# Altium schematic sheet Sheet2 (3).SchDoc
size Legal
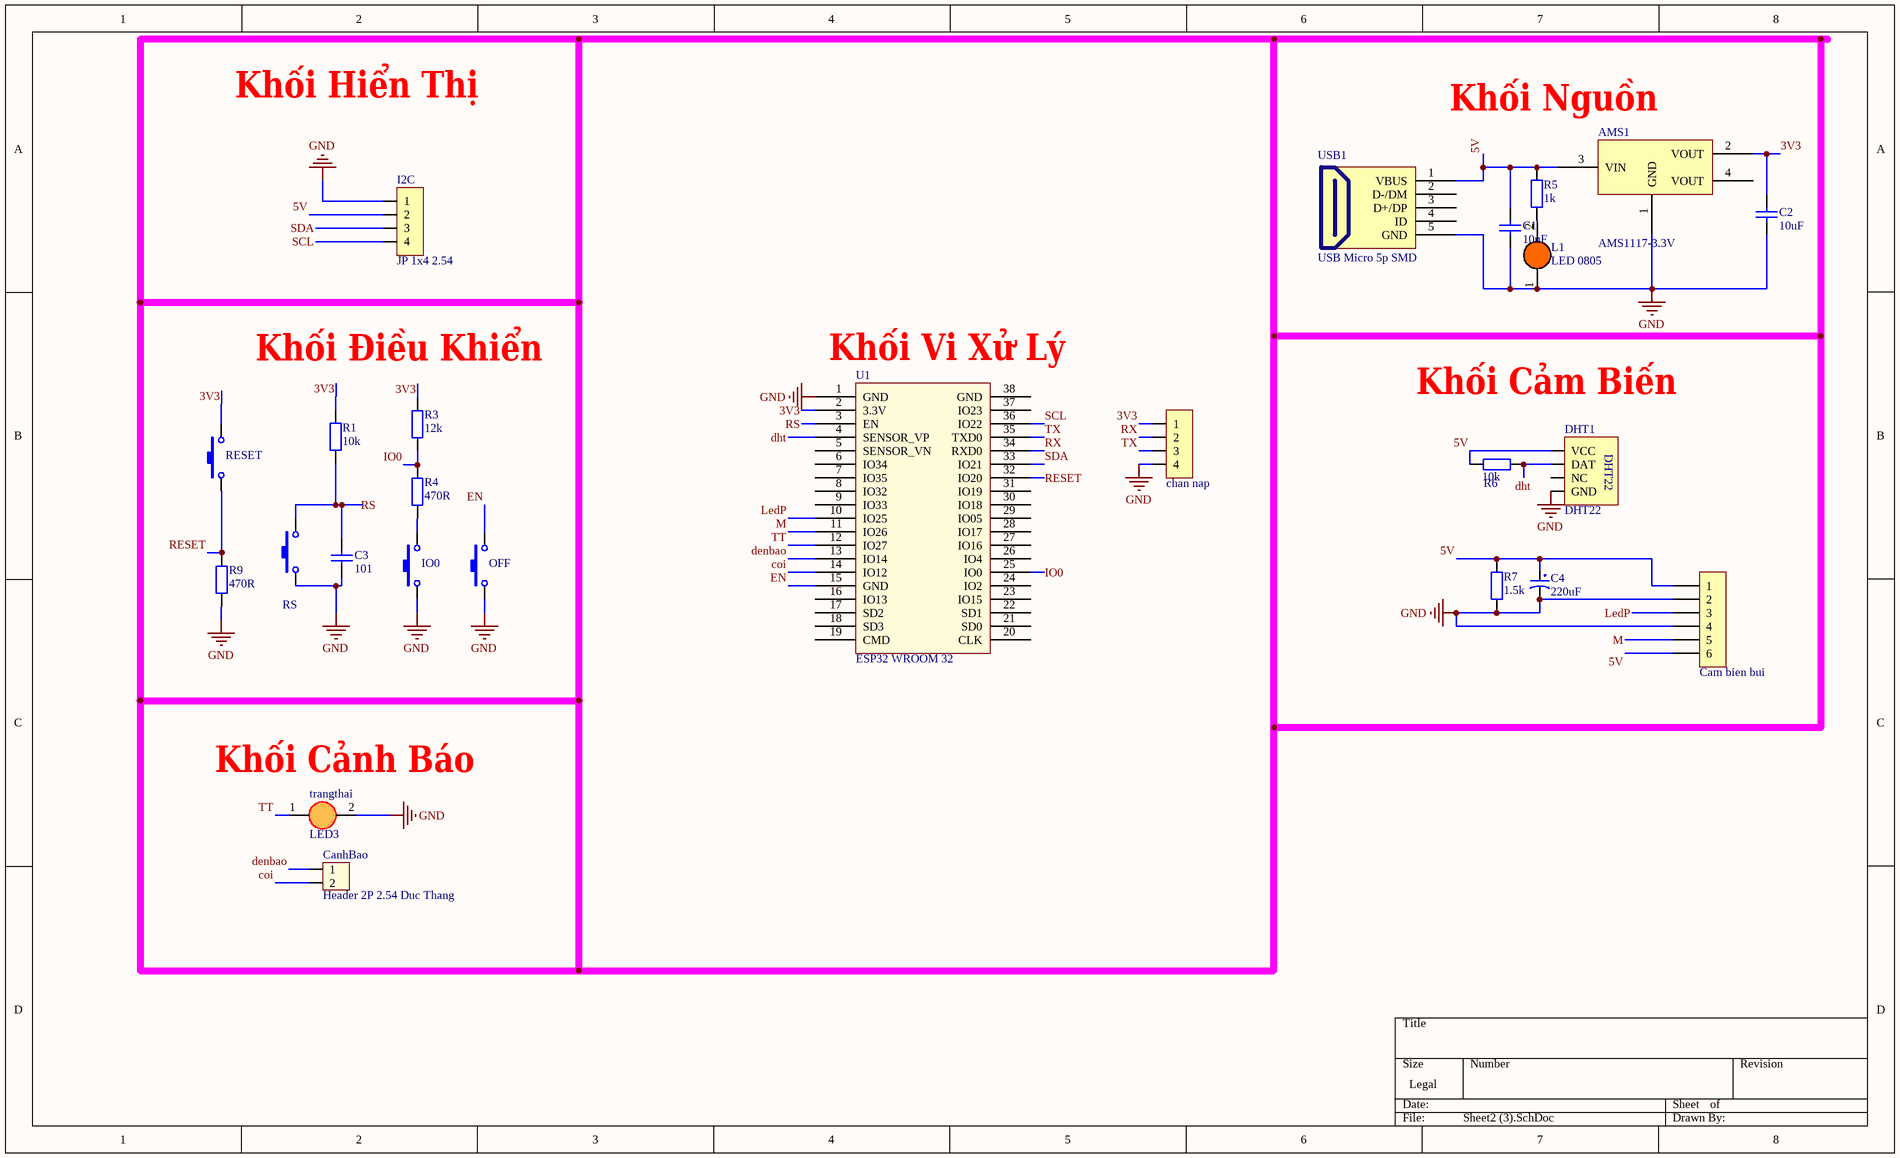
[diagram p0: Sheet2 (3).SchDoc]

## Parts
AMS1  AMS1117-3.3V  [SOT223]
C1  10uF  [tu 0805]
C2  10uF  [tu 0805]
C3  101  [tu 0805]
C4  220uF  [Tu hoa 5mm]
Cam_bien_bui  Cam bien bui  [XH2.54M-6]
CanhBao  Header 2P 2.54 Duc Thang  [XH2.54M-2]
DHT1  DHT22  [DHT22]
I2C  JP 1x4 2.54  [JP 1x4 DT]
IO0  Nut Nhan 2 Chan SMD 3x6x2.5  [Nut Nhan 2 Chan SMD 3x6x2.5]  (value not drawn)
JP1  chan nap  [JP 1x4 CT]
L1  LED 0805  [LED-0805-Orange]
OFF  Nut Nhan 2 Chan SMD 3x6x2.5  [Nut Nhan 2 Chan SMD 3x6x2.5]  (value not drawn)
R1  10k  [tro smd 0805]
R3  12k  [tro smd 0805]
R4  470R  [Tro SMD 0805]
R5  1k  [tro smd 0805]
R6  10k  [tro smd 0805]
R7  1.5k  [tro vach 1/4w]
R9  470R  [Tro SMD 0805]
RESET  Nut Nhan 2 Chan SMD 3x6x2.5  [Nut Nhan 2 Chan SMD 3x6x2.5]  (value not drawn)
RS  Nut Nhan 2 Chan SMD 3x6x2.5  [Nut Nhan 2 Chan SMD 3x6x2.5]  (value not drawn)
trangthai  LED3  [LED3mm]
U1  ESP32 WROOM 32  [ESP32-WROOM-32D]
USB1  USB Micro 5p SMD  [USB Micro 5p SMD]

## Nets
GND: AMS1.1(GND) C1.2 C2.2 C3.2 C4.2 Cam_bien_bui.2 Cam_bien_bui.4 DHT1.4(GND) I2C.1 IO0.1 JP1.4 L1.1(A) OFF.1 R7.1 R9.1 RS.1 trangthai.2(K) U1.1(GND) USB1.5(GND)
3V3: AMS1.2(VOUT) C2.1 JP1.1 R1.2 R3.2 RESET.2 U1.2(3.3V)
5V: AMS1.3(VIN) C1.1 C4.1 Cam_bien_bui.1 Cam_bien_bui.6 DHT1.1(VCC) I2C.2 R5.2 R6.1 R7.2 USB1.1(VBUS)
coi: CanhBao.2 U1.14(IO12)
denbao: CanhBao.1 U1.13(IO14)
dht: DHT1.2(DAT) R6.2 U1.4(SENSOR_VP)
EN: OFF.2 U1.15(GND)
IO0: R3.1 R4.2 U1.25(IO0)
LedP: Cam_bien_bui.3 U1.10(IO25)
M: Cam_bien_bui.5 U1.11(IO26)
RESET: R9.2 RESET.1 U1.32(IO20)
RS: C3.1 R1.1 RS.2 U1.3(EN)
RX: JP1.2 U1.34(RXD0)
SCL: I2C.4 U1.36(IO22)
SDA: I2C.3 U1.33(IO21)
TT: trangthai.1(A) U1.12(IO27)
TX: JP1.3 U1.35(TXD0)
NetIO0_2: IO0.2 R4.1
NetL1_2: L1.2(K) R5.1

Not connected (* = marked no-connect by the designer): AMS1 4(VOUT); DHT1 3(NC); U1 5(SENSOR_VN) 6(IO34) 7(IO35) 8(IO32) 9(IO33) 16(IO13) 17(SD2) 18(SD3) 19(CMD) 20(CLK) 21(SD0) 22(SD1) 23(IO15) 24(IO2) 26(IO4) 27(IO16) 28(IO17) 29(IO05) 30(IO18) 31(IO19) 37(IO23) 38(GND); USB1 2(D-/DM) 3(D+/DP) 4(ID)

## Notes on the sheet
- Khối Hiển Thị
- (near AMS1) Khối Nguồn
- Khối Điều Khiển
- (near U1) Khối Vi Xử Lý
- Khối Cảm Biến
- (near trangthai) Khối Cảnh Báo

## Library data of the parts
AMS1 = AMS1117 SMD: Dán; Value: AMS1117-3.3V SOT223; Don_Vi: Con; Ma_Hang: MH000596; Ghi_Chu: *; Kieu_Chan: *; Chung_Loai: Dán
C1 C2 = Tu 0805 10pF 50V 10%: Dán; Don_Vi: Con; So_Chan: 2; Ten_Linh_Kien: Tụ 0805 10P 10% 50V; Ma_Hang: MH004554; Chung_Loai: Dán; Kieu_Chan: *
C3 = Tu 0805 101 50V 20%: Dán; Don_Vi: Con; So_Chan: 2; Ten_Linh_Kien: Tụ 0805 101-0.1nF 50V 20%; Ma_Hang: MH002806; Chung_Loai: Dán; Kieu_Chan: *
C4 = Tu Hoa 220uF 16V 6x11: Cắm; Don_Vi: Con; So_Chan: 2; Ten_Linh_Kien: Tụ Hóa 220uF 16V 6x11MM; Ma_Hang: MH001348; Chung_Loai: Cắm; Kieu_Chan: *
Cam_bien_bui = Header 6P 2.54 Duc Thang: Cắm; Ten_Linh_Kien: Header 6P XH2.54-6P Đực Thẳng; Don_Vi: Con; Ma_Hang: MH001972; Chung_Loai: Cắm
CanhBao = Header 2P 2.54 Duc Thang: Cắm; Ten_Linh_Kien: Header 2P XH2.54-2P Đực Thẳng; Don_Vi: Con; Ma_Hang: MH001283; Chung_Loai: Cắm
DHT1 = DHT22: Manufacturer: W¨¹rth Elektronik eiSos GmbH; partNo: 613004143121; ComponentLink1 Description: Manufacturer; ComponentLink2 Description: Datasheet; NoPins: 04; Created Date: 29 March 2013; ComponentLink1URL: http://www.we-online.com; ComponentLink2URL: http://katalog.we-online.de/em/datasheet/6130xx143121.pdf; Created by: Karrer Zheng
I2C = JP 1x4 2.54 Duc Thang: Cắm; Ten_Linh_Kien: Jump Đơn Đực 2.54MM 1x40P Thẳng 11MM; Don_Vi: Con; Ma_Hang: MH000903; Ghi_Chu: *; Kieu_Chan: *; Chung_Loai: Cắm
IO0 OFF RESET RS = Nut Nhan 2 Chan SMD 3x6x2.5: Ma_Hang: MH001036; Ten: Nút Nhấn 2 Chân 3x6x2.5MM SMD
JP1 = JP 1x4 2.54 Cai Thang: Cắm; Ten_Linh_Kien: Jump Đơn Cái 2.54MM 1x20P Thẳng; Don_Vi: Con; Ma_Hang: MH004006; Ghi_Chu: *; Kieu_Chan: *; Chung_Loai: Cắm
L1 = LED 0805 Cam: Dán; Don_Vi: Con; Ma_Hang: MH002328; Ten_Linh_Kien: LED 0805 Màu Cam ( Orange); Ghi_Chu: *; Kieu_Chan: *; Chung_Loai: Dán
R1 = Tro 0805 1% 10k: Dán; Don_Vi: Con; So_Chan: 2; Ten_Linh_Kien: Trở 0805 1% 10k; Ma_Hang: MH005473; Chung_Loai: Dán; Kieu_Chan: *
R3 = Tro 0805 5% 12k: Dán; Don_Vi: Con; So_Chan: 2; Ten_Linh_Kien: Trở 0805 5% 12k; Ma_Hang: MH005241; Chung_Loai: Dán; Kieu_Chan: *
R4 R9 = Tro 0805 5% 470R: Dán; Don_Vi: Con; Ma_Hang: MH005341; Ten_Linh_Kien: Trở 0805 5% 470R; So_Chan: 2; Chung_Loai: Dán; Kieu_Chan: *
R5 = Tro 0805 1% 1k: Dán; Don_Vi: Con; So_Chan: 2; Ten_Linh_Kien: Trở 0805 1% 1k; Ma_Hang: MH005468; Chung_Loai: Dán; Kieu_Chan: *
R6 = Tro 0805 5% 10k: Dán; Don_Vi: Con; So_Chan: 2; Ten_Linh_Kien: Trở 0805 5% 10k; Ma_Hang: MH005239; Chung_Loai: Dán; Kieu_Chan: *
R7 = Tro Vach 1/4W 5% 1.5k: Cắm; Don_Vi: Con; So_Chan: 2; Ten_Linh_Kien: Trở Vạch 1/4w 5% 1.5k; Ma_Hang: MH007284; Chung_Loai: Cắm; Kieu_Chan: *
trangthai = LED 3mm
USB1 = USB Micro 5p SMD: USB Type B; Ten: MicroUSB MK5P SMD; Ma_Hang: MH001020